# EAGLE schematic nedo1802_v1_0 (EAGLE 5.01)

## Sheet 1 of 2
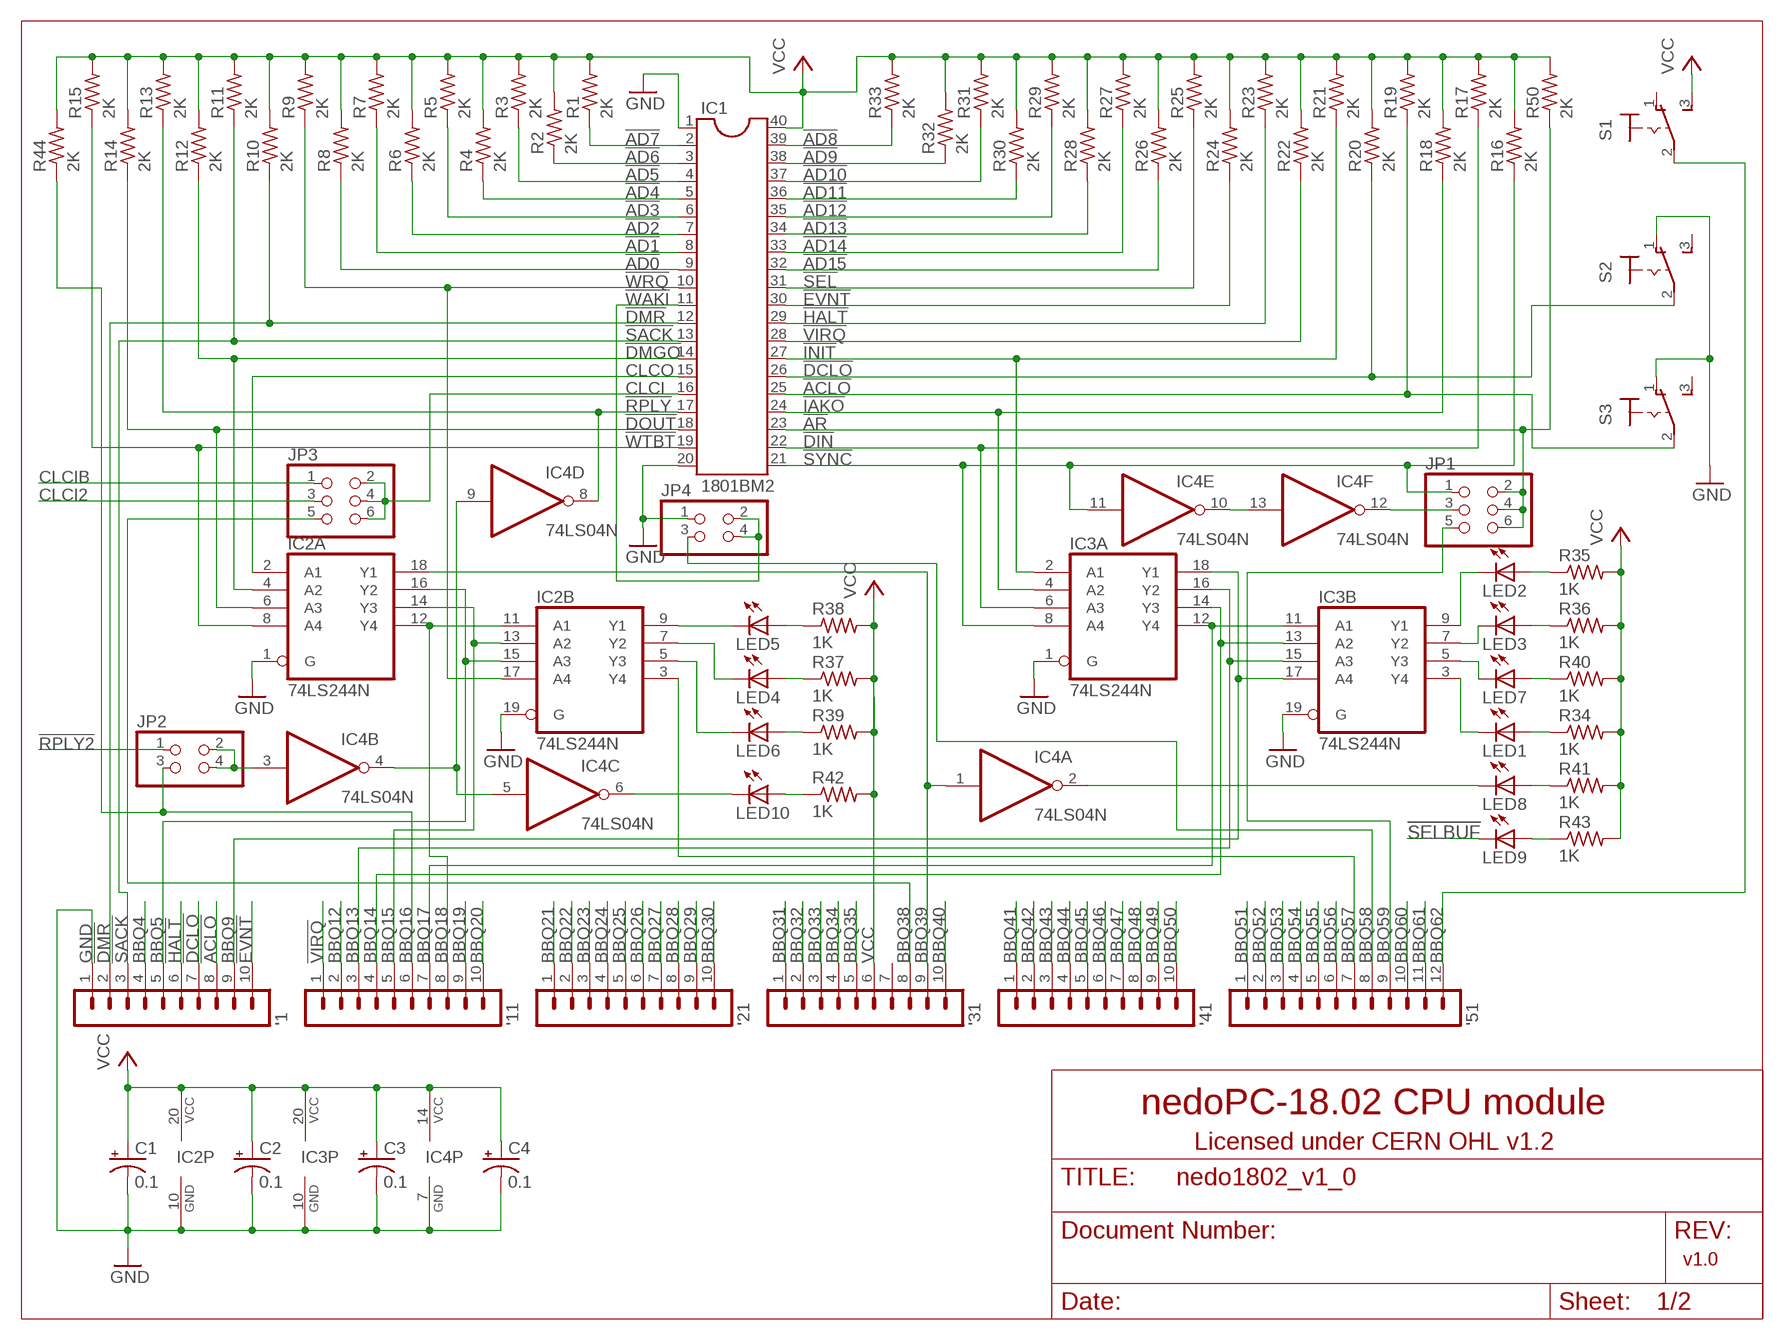
[diagram p0: schematic, sheet 1]

### Parts
'1  MA10-1  [MA10-1]
'11  MA10-1  [MA10-1]
'21  MA10-1  [MA10-1]
'31  MA10-1  [MA10-1]
'41  MA10-1  [MA10-1]
'51  MA12-1  [MA12-1]
C1  0.1  CPOL-USB45181B  [B45181B]
C2  0.1  CPOL-USB45181B  [B45181B]
C3  0.1  CPOL-USB45181B  [B45181B]
C4  0.1  CPOL-USB45181B  [B45181B]
IC1  1801BM2  DIL40  [DIL40]
IC2  74LS244N  [DIL20]
IC3  74LS244N  [DIL20]
IC4  74LS04N  [DIL14]
JP1  PINHD-2X3  [2X03]
JP2  PINHD-2X2  [2X02]
JP3  PINHD-2X3  [2X03]
JP4  PINHD-2X2  [2X02]
LED1  LED5MM  [LED5MM]
LED2  LED5MM  [LED5MM]
LED3  LED5MM  [LED5MM]
LED4  LED5MM  [LED5MM]
LED5  LED5MM  [LED5MM]
LED6  LED5MM  [LED5MM]
LED7  LED5MM  [LED5MM]
LED8  LED5MM  [LED5MM]
LED9  LED5MM  [LED5MM]
LED10  LED5MM  [LED5MM]
R1  2K  R-US_0204/7  [0204/7]
R2  2K  R-US_0204/7  [0204/7]
R3  2K  R-US_0204/7  [0204/7]
R4  2K  R-US_0204/7  [0204/7]
R5  2K  R-US_0204/7  [0204/7]
R6  2K  R-US_0204/7  [0204/7]
R7  2K  R-US_0204/7  [0204/7]
R8  2K  R-US_0204/7  [0204/7]
R9  2K  R-US_0204/7  [0204/7]
R10  2K  R-US_0204/7  [0204/7]
R11  2K  R-US_0204/7  [0204/7]
R12  2K  R-US_0204/7  [0204/7]
R13  2K  R-US_0204/7  [0204/7]
R14  2K  R-US_0204/7  [0204/7]
R15  2K  R-US_0204/7  [0204/7]
R16  2K  R-US_0204/7  [0204/7]
R17  2K  R-US_0204/7  [0204/7]
R18  2K  R-US_0204/7  [0204/7]
R19  2K  R-US_0204/7  [0204/7]
R20  2K  R-US_0204/7  [0204/7]
R21  2K  R-US_0204/7  [0204/7]
R22  2K  R-US_0204/7  [0204/7]
R23  2K  R-US_0204/7  [0204/7]
R24  2K  R-US_0204/7  [0204/7]
R25  2K  R-US_0204/7  [0204/7]
R26  2K  R-US_0204/7  [0204/7]
R27  2K  R-US_0204/7  [0204/7]
R28  2K  R-US_0204/7  [0204/7]
R29  2K  R-US_0204/7  [0204/7]
R30  2K  R-US_0204/7  [0204/7]
R31  2K  R-US_0204/7  [0204/7]
R32  2K  R-US_0204/7  [0204/7]
R33  2K  R-US_0204/7  [0204/7]
R34  1K  R-US_0204/7  [0204/7]
R35  1K  R-US_0204/7  [0204/7]
R36  1K  R-US_0204/7  [0204/7]
R37  1K  R-US_0204/7  [0204/7]
R38  1K  R-US_0204/7  [0204/7]
R39  1K  R-US_0204/7  [0204/7]
R40  1K  R-US_0204/7  [0204/7]
R41  1K  R-US_0204/7  [0204/7]
R42  1K  R-US_0204/7  [0204/7]
R43  1K  R-US_0204/7  [0204/7]
R44  2K  R-US_0204/7  [0204/7]
R50  2K  R-US_0204/7  [0204/7]
S1  320-916  [320-916]
S2  320-916  [320-916]
S3  320-916  [320-916]

### Nets
!ACLO: '1.8 IC1.25 R19.1 S3.2(P)
!AD0: IC1.9 R8.1 ; also sheet 2
!AD1: IC1.8 R7.1 ; also sheet 2
!AD2: IC1.7 R6.1 ; also sheet 2
!AD3: IC1.6 R5.1 ; also sheet 2
!AD4: IC1.5 R4.1 ; also sheet 2
!AD5: IC1.4 R3.1 ; also sheet 2
!AD6: IC1.3 R2.1 ; also sheet 2
!AD7: IC1.2 R1.1 ; also sheet 2
!AD8: IC1.39 R33.1 ; also sheet 2
!AD9: IC1.38 R32.1 ; also sheet 2
!AD10: IC1.37 R31.1 ; also sheet 2
!AD11: IC1.36 R30.1 ; also sheet 2
!AD12: IC1.35 R29.1 ; also sheet 2
!AD13: IC1.34 R28.1 ; also sheet 2
!AD14: IC1.33 R27.1 ; also sheet 2
!AD15: IC1.32 R26.1 ; also sheet 2
!AR: IC1.23 JP1.2 JP1.4 JP1.6 R50.1
!DCLO: '1.7 IC1.26 R20.1 S2.2(P)
!DIN: IC1.22 IC3.6(A:A3) R17.1
!DMGO: IC1.14 IC2.4(A:A2) R12.1
!DMR: '1.2 IC1.12 R10.1
!DOUT: IC1.18 IC2.6(A:A3) R14.1
!EVNT: '1.10 IC1.30 R24.1
!HALT: '1.6 IC1.29 R23.1
!IAKO: IC1.24 IC3.4(A:A2) R18.1
!INIT: IC1.27 IC3.2(A:A1) R21.1
!RPLY: IC1.17 IC4.8(D:O) R13.1
!RPLY2: JP2.1 ; also sheet 2
!SACK: '1.3 IC1.13 R11.1
!SEL: IC1.31 R25.1 ; also sheet 2
!SELBUF: LED9.K(C) ; also sheet 2
!SYNC: IC1.21 IC3.8(A:A4) IC4.11(E:I) JP1.1 R16.1
!VIRQ: '11.1 IC1.28 R22.1
!WAKI: IC1.11 JP4.2 JP4.4
!WRQ: IC1.10 IC2.17(B:A4) R9.1
!WTBT: IC1.19 IC2.8(A:A4) R15.1
BBQ4: '1.4
BBQ5: '1.5 IC2.15(B:A3) IC2.16(A:Y2)
BBQ9: '1.9 IC3.17(B:A4) IC3.18(A:Y1) ; also sheet 2
BBQ12: '11.2
BBQ13: '11.3 IC3.15(B:A3) IC3.16(A:Y2) ; also sheet 2
BBQ14: '11.4 IC3.13(B:A2) IC3.14(A:Y3) ; also sheet 2
BBQ15: '11.5 IC2.13(B:A2) IC2.14(A:Y3) ; also sheet 2
BBQ16: '11.6 JP2.3 R44.1
BBQ17: '11.7 IC3.11(B:A1) IC3.12(A:Y4) ; also sheet 2
BBQ18: '11.8 IC2.11(B:A1) IC2.12(A:Y4)
BBQ19: '11.9 ; also sheet 2
BBQ20: '11.10 ; also sheet 2
BBQ21: '21.1 ; also sheet 2
BBQ22: '21.2 ; also sheet 2
BBQ23: '21.3 ; also sheet 2
BBQ24: '21.4 ; also sheet 2
BBQ25: '21.5 ; also sheet 2
BBQ26: '21.6 ; also sheet 2
BBQ27: '21.7 ; also sheet 2
BBQ28: '21.8 ; also sheet 2
BBQ29: '21.9 ; also sheet 2
BBQ30: '21.10 ; also sheet 2
BBQ31: '31.1 ; also sheet 2
BBQ32: '31.2 ; also sheet 2
BBQ33: '31.3 ; also sheet 2
BBQ34: '31.4 ; also sheet 2
BBQ35: '31.5 ; also sheet 2
BBQ38: '31.8 JP3.5
BBQ39: '31.9 IC2.18(A:Y1) IC4.1(A:I) ; also sheet 2
BBQ40: '31.10 ; also sheet 2
BBQ41: '41.1 ; also sheet 2
BBQ42: '41.2 ; also sheet 2
BBQ43: '41.3 ; also sheet 2
BBQ44: '41.4 ; also sheet 2
BBQ45: '41.5 ; also sheet 2
BBQ46: '41.6 ; also sheet 2
BBQ47: '41.7 ; also sheet 2
BBQ48: '41.8 ; also sheet 2
BBQ49: '41.9 ; also sheet 2
BBQ50: '41.10 ; also sheet 2
BBQ51: '51.1 ; also sheet 2
BBQ52: '51.2 ; also sheet 2
BBQ53: '51.3 ; also sheet 2
BBQ54: '51.4 ; also sheet 2
BBQ55: '51.5 ; also sheet 2
BBQ56: '51.6 ; also sheet 2
BBQ57: '51.7 IC2.3(B:Y4)
BBQ58: '51.8 JP4.3
BBQ59: '51.9 JP1.5
BBQ60: '51.10
BBQ61: '51.11
BBQ62: '51.12 S1.2(P)
CLCI: IC1.16 JP3.2 JP3.4 JP3.6
CLCI2: JP3.3 ; also sheet 2
CLCIB: JP3.1 ; also sheet 2
CLCO: IC1.15 IC2.2(A:A1)
GND: '1.1 C1.- C2.- C3.- C4.- IC1.1 IC1.20 IC2.1(A:G) IC2.10(P:GND) IC2.19(B:G) IC3.1(A:G) IC3.10(P:GND) IC3.19(B:G) IC4.7(P:GND) JP4.1 S2.1(O) S3.1(O) ; also sheet 2
N$1: IC3.7(B:Y2) LED3.K(C)
N$2: IC3.5(B:Y3) LED7.K(C)
N$3: IC3.3(B:Y4) LED1.K(C)
N$4: IC3.9(B:Y1) LED2.K(C)
N$5: IC2.7(B:Y2) LED4.K(C)
N$6: IC2.5(B:Y3) LED6.K(C)
N$7: IC2.9(B:Y1) LED5.K(C)
N$8: LED5.A R38.1
N$9: LED4.A R37.1
N$10: LED6.A R39.1
N$11: IC4.4(B:O) IC4.5(C:I) IC4.9(D:I)
N$12: LED1.A R34.1
N$13: LED7.A R40.1
N$14: LED3.A R36.1
N$15: LED2.A R35.1
N$16: LED8.A R41.1
N$17: IC4.2(A:O) LED8.K(C)
N$18: LED10.A R42.1
N$19: IC4.6(C:O) LED10.K(C)
N$20: IC4.3(B:I) JP2.2 JP2.4
N$21: IC4.12(F:O) JP1.3
N$47: IC4.10(E:O) IC4.13(F:I)
N$51: LED9.A R43.1
VCC: '31.6 C1.+ C2.+ C3.+ C4.+ IC1.40 IC2.20(P:VCC) IC3.20(P:VCC) IC4.14(P:VCC) R1.2 R2.2 R3.2 R4.2 R5.2 R6.2 R7.2 R8.2 R9.2 R10.2 R11.2 R12.2 R13.2 R14.2 R15.2 R16.2 R17.2 R18.2 R19.2 R20.2 R21.2 R22.2 R23.2 R24.2 R25.2 R26.2 R27.2 R28.2 R29.2 R30.2 R31.2 R32.2 R33.2 R34.2 R35.2 R36.2 R37.2 R38.2 R39.2 R40.2 R41.2 R42.2 R43.2 R44.2 R50.2 S1.3(S) ; also sheet 2
Unconnected: '31.7 S1.1(O) S2.3(S) S3.3(S)

### Notes on the sheet
- nedoPC-18.02 CPU module
- Licensed under CERN OHL v1.2
- v1.0

## Sheet 2 of 2
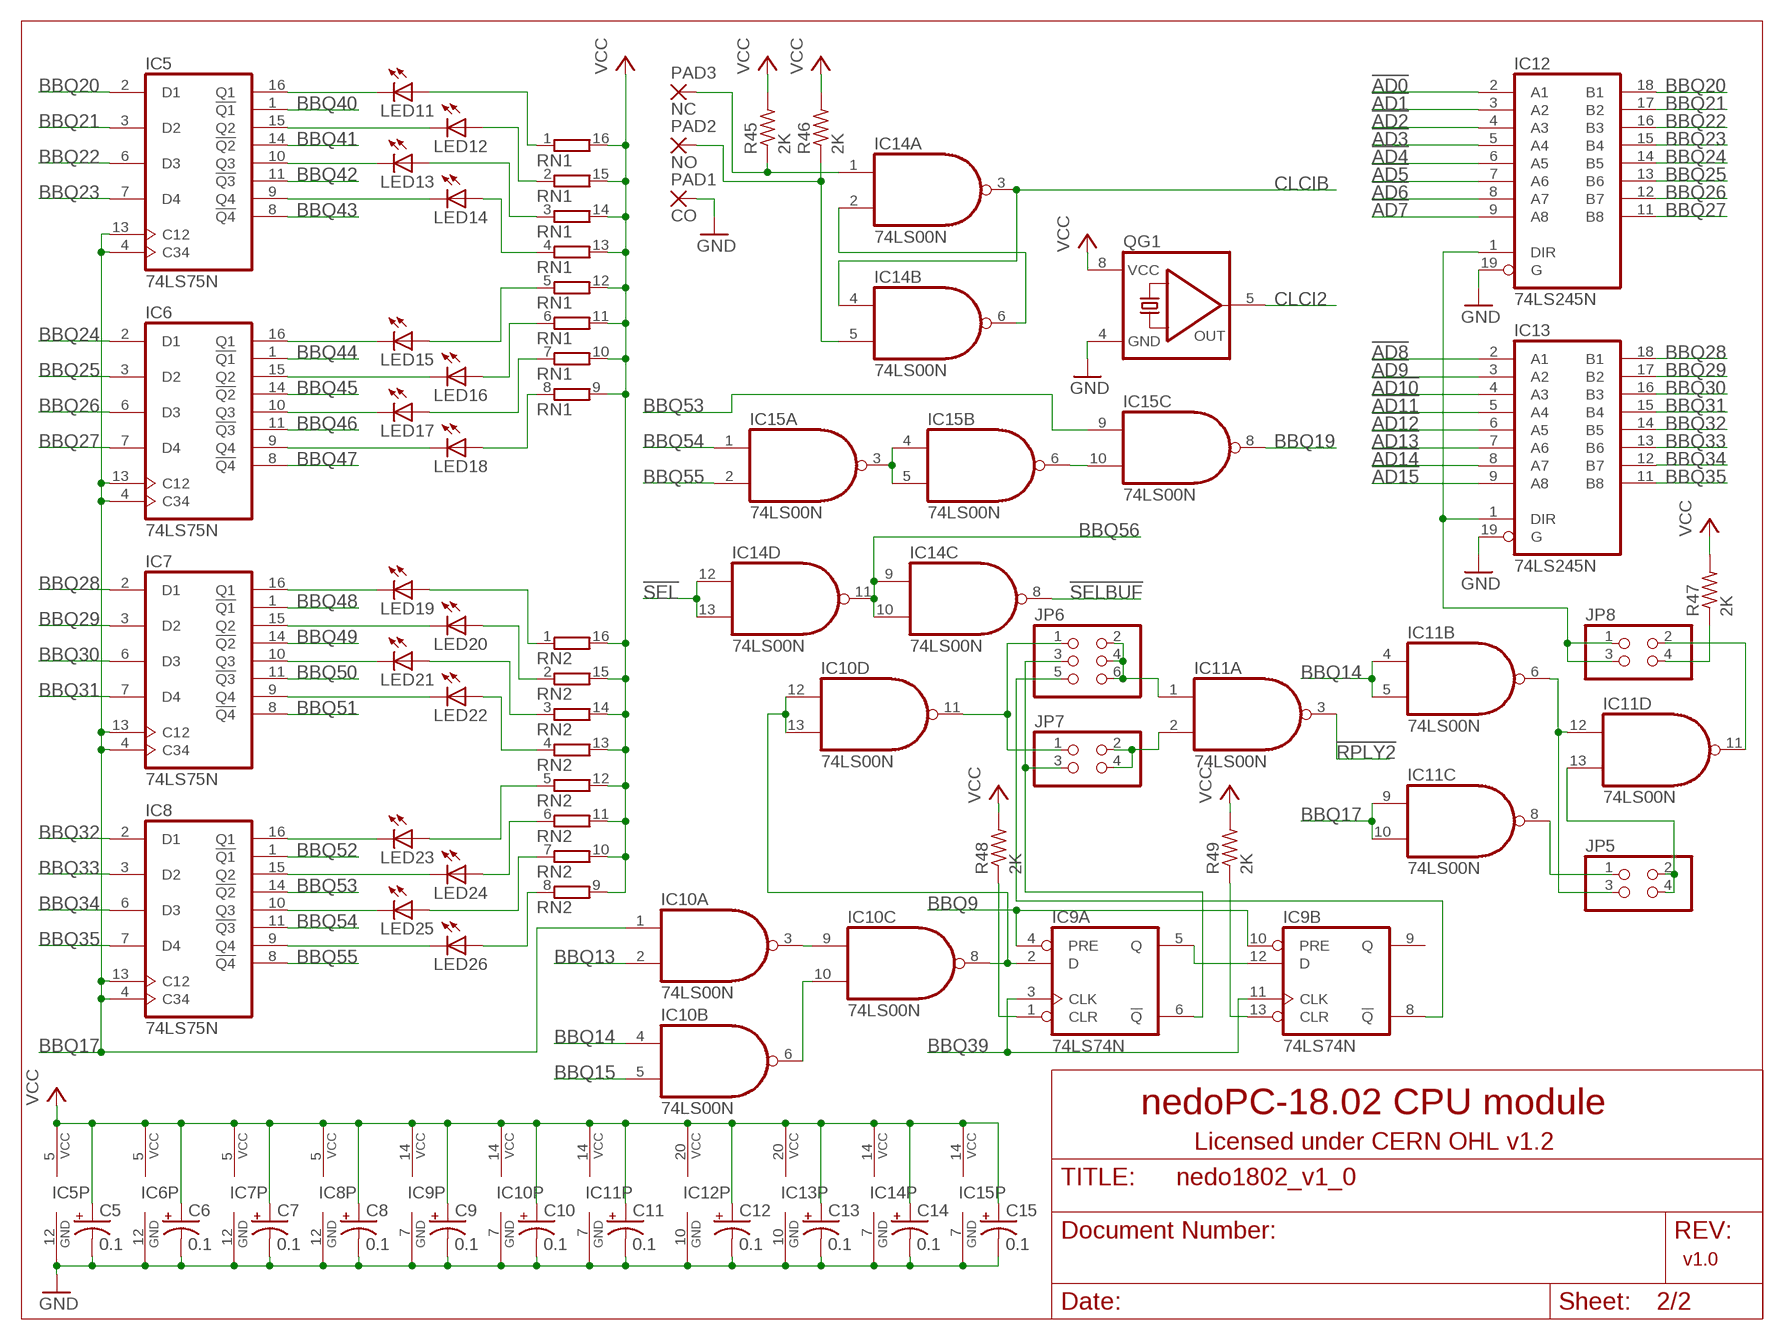
[diagram p1: schematic, sheet 2]

### Parts
C5  0.1  CPOL-USB45181B  [B45181B]
C6  0.1  CPOL-USB45181B  [B45181B]
C7  0.1  CPOL-USB45181B  [B45181B]
C8  0.1  CPOL-USB45181B  [B45181B]
C9  0.1  CPOL-USB45181B  [B45181B]
C10  0.1  CPOL-USB45181B  [B45181B]
C11  0.1  CPOL-USB45181B  [B45181B]
C12  0.1  CPOL-USB45181B  [B45181B]
C13  0.1  CPOL-USB45181B  [B45181B]
C14  0.1  CPOL-USB45181B  [B45181B]
C15  0.1  CPOL-USB45181B  [B45181B]
IC5  74LS75N  [DIL16]
IC6  74LS75N  [DIL16]
IC7  74LS75N  [DIL16]
IC8  74LS75N  [DIL16]
IC9  74LS74N  [DIL14]
IC10  74LS00N  [DIL14]
IC11  74LS00N  [DIL14]
IC12  74LS245N  [DIL20]
IC13  74LS245N  [DIL20]
IC14  74LS00N  [DIL14]
IC15  74LS00N  [DIL14]
JP5  PINHD-2X2  [2X02]
JP6  PINHD-2X3  [2X03]
JP7  PINHD-2X2  [2X02]
JP8  PINHD-2X2  [2X02]
LED11  LED3MM  [LED3MM]
LED12  LED3MM  [LED3MM]
LED13  LED3MM  [LED3MM]
LED14  LED3MM  [LED3MM]
LED15  LED3MM  [LED3MM]
LED16  LED3MM  [LED3MM]
LED17  LED3MM  [LED3MM]
LED18  LED3MM  [LED3MM]
LED19  LED3MM  [LED3MM]
LED20  LED3MM  [LED3MM]
LED21  LED3MM  [LED3MM]
LED22  LED3MM  [LED3MM]
LED23  LED3MM  [LED3MM]
LED24  LED3MM  [LED3MM]
LED25  LED3MM  [LED3MM]
LED26  LED3MM  [LED3MM]
PAD1  CO  WIREPAD4,16O1,6  [4,16O1,6]
PAD2  NO  WIREPAD4,16O1,6  [4,16O1,6]
PAD3  NC  WIREPAD4,16O1,6  [4,16O1,6]
QG1  QG5460  [DIL08S]
R45  2K  R-US_0204/7  [0204/7]
R46  2K  R-US_0204/7  [0204/7]
R47  2K  R-US_0204/7  [0204/7]
R48  2K  R-US_0204/7  [0204/7]
R49  2K  R-US_0204/7  [0204/7]
RN1  8R-P  [DIL16]
RN2  8R-P  [DIL16]

### Nets
!AD0: IC12.2(A1) ; also sheet 1
!AD1: IC12.3(A2) ; also sheet 1
!AD2: IC12.4(A3) ; also sheet 1
!AD3: IC12.5(A4) ; also sheet 1
!AD4: IC12.6(A5) ; also sheet 1
!AD5: IC12.7(A6) ; also sheet 1
!AD6: IC12.8(A7) ; also sheet 1
!AD7: IC12.9(A8) ; also sheet 1
!AD8: IC13.2(A1) ; also sheet 1
!AD9: IC13.3(A2) ; also sheet 1
!AD10: IC13.4(A3) ; also sheet 1
!AD11: IC13.5(A4) ; also sheet 1
!AD12: IC13.6(A5) ; also sheet 1
!AD13: IC13.7(A6) ; also sheet 1
!AD14: IC13.8(A7) ; also sheet 1
!AD15: IC13.9(A8) ; also sheet 1
!RPLY2: IC11.3(A:O) ; also sheet 1
!SEL: IC14.12(D:I0) IC14.13(D:I1) ; also sheet 1
!SELBUF: IC14.8(C:O) ; also sheet 1
BBQ9: IC9.4(A:PRE) IC9.10(B:PRE) ; also sheet 1
BBQ13: IC10.2(A:I1) ; also sheet 1
BBQ14: IC10.4(B:I0) IC11.4(B:I0) IC11.5(B:I1) ; also sheet 1
BBQ15: IC10.5(B:I1) ; also sheet 1
BBQ17: IC5.4(C34) IC5.13(C12) IC6.4(C34) IC6.13(C12) IC7.4(C34) IC7.13(C12) IC8.4(C34) IC8.13(C12) IC10.1(A:I0) IC11.9(C:I0) IC11.10(C:I1) ; also sheet 1
BBQ19: IC15.8(C:O) ; also sheet 1
BBQ20: IC5.2(D1) IC12.18(B1) ; also sheet 1
BBQ21: IC5.3(D2) IC12.17(B2) ; also sheet 1
BBQ22: IC5.6(D3) IC12.16(B3) ; also sheet 1
BBQ23: IC5.7(D4) IC12.15(B4) ; also sheet 1
BBQ24: IC6.2(D1) IC12.14(B5) ; also sheet 1
BBQ25: IC6.3(D2) IC12.13(B6) ; also sheet 1
BBQ26: IC6.6(D3) IC12.12(B7) ; also sheet 1
BBQ27: IC6.7(D4) IC12.11(B8) ; also sheet 1
BBQ28: IC7.2(D1) IC13.18(B1) ; also sheet 1
BBQ29: IC7.3(D2) IC13.17(B2) ; also sheet 1
BBQ30: IC7.6(D3) IC13.16(B3) ; also sheet 1
BBQ31: IC7.7(D4) IC13.15(B4) ; also sheet 1
BBQ32: IC8.2(D1) IC13.14(B5) ; also sheet 1
BBQ33: IC8.3(D2) IC13.13(B6) ; also sheet 1
BBQ34: IC8.6(D3) IC13.12(B7) ; also sheet 1
BBQ35: IC8.7(D4) IC13.11(B8) ; also sheet 1
BBQ39: IC9.3(A:CLK) IC9.11(B:CLK) ; also sheet 1
BBQ40: IC5.1(!Q1) ; also sheet 1
BBQ41: IC5.14(!Q2) ; also sheet 1
BBQ42: IC5.11(!Q3) ; also sheet 1
BBQ43: IC5.8(!Q4) ; also sheet 1
BBQ44: IC6.1(!Q1) ; also sheet 1
BBQ45: IC6.14(!Q2) ; also sheet 1
BBQ46: IC6.11(!Q3) ; also sheet 1
BBQ47: IC6.8(!Q4) ; also sheet 1
BBQ48: IC7.1(!Q1) ; also sheet 1
BBQ49: IC7.14(!Q2) ; also sheet 1
BBQ50: IC7.11(!Q3) ; also sheet 1
BBQ51: IC7.8(!Q4) ; also sheet 1
BBQ52: IC8.1(!Q1) ; also sheet 1
BBQ53: IC8.14(!Q2) IC15.9(C:I0) ; also sheet 1
BBQ54: IC8.11(!Q3) IC15.1(A:I0) ; also sheet 1
BBQ55: IC8.8(!Q4) IC15.2(A:I1) ; also sheet 1
BBQ56: IC14.9(C:I0) IC14.10(C:I1) IC14.11(D:O) ; also sheet 1
CLCI2: QG1.5(OUT) ; also sheet 1
CLCIB: IC14.3(A:O) IC14.4(B:I0) ; also sheet 1
GND: C5.- C6.- C7.- C8.- C9.- C10.- C11.- C12.- C13.- C14.- C15.- IC5.12(GND) IC6.12(GND) IC7.12(GND) IC8.12(GND) IC9.7(P:GND) IC10.7(P:GND) IC11.7(P:GND) IC12.10(GND) IC12.19(G) IC13.10(GND) IC13.19(G) IC14.7(P:GND) IC15.7(P:GND) PAD1.1(P) QG1.4(GND) ; also sheet 1
N$22: IC9.1(A:CLR) R48.1
N$23: IC5.16(Q1) LED11.K(C)
N$24: LED14.A RN1.4
N$25: LED13.A RN1.3
N$26: LED12.A RN1.2
N$27: LED11.A RN1.1
N$28: IC12.1(DIR) IC13.1(DIR) JP8.1 JP8.3
N$29: LED15.A RN1.5
N$30: LED16.A RN1.6
N$31: LED17.A RN1.7
N$32: LED18.A RN1.8
N$33: LED19.A RN2.1
N$34: LED20.A RN2.2
N$35: LED21.A RN2.3
N$36: LED22.A RN2.4
N$37: LED23.A RN2.5
N$38: LED24.A RN2.6
N$39: LED25.A RN2.7
N$40: LED26.A RN2.8
N$41: IC11.6(B:O) IC11.12(D:I0) JP5.3
N$42: IC5.15(Q2) LED12.K(C)
N$43: IC11.8(C:O) JP5.1
N$44: IC5.10(Q3) LED13.K(C)
N$45: IC11.13(D:I1) JP5.2 JP5.4
N$46: IC5.9(Q4) LED14.K(C)
N$48: IC6.16(Q1) LED15.K(C)
N$49: IC9.13(B:CLR) R49.1
N$50: IC6.15(Q2) LED16.K(C)
N$52: IC6.10(Q3) LED17.K(C)
N$53: IC9.5(A:Q) IC9.12(B:D)
N$54: IC6.9(Q4) LED18.K(C)
N$55: IC10.3(A:O) IC10.9(C:I0)
N$56: IC7.16(Q1) LED19.K(C)
N$57: IC10.6(B:O) IC10.10(C:I1)
N$58: IC7.15(Q2) LED20.K(C)
N$59: IC11.11(D:O) JP8.2
N$60: IC7.10(Q3) LED21.K(C)
N$62: IC7.9(Q4) LED22.K(C)
N$63: IC9.6(A:!Q) JP6.3 JP7.3
N$64: IC8.16(Q1) LED23.K(C)
N$65: IC9.8(B:!Q) JP6.5
N$66: IC8.15(Q2) LED24.K(C)
N$67: IC11.1(A:I0) JP6.2 JP6.4 JP6.6
N$68: IC8.10(Q3) LED25.K(C)
N$69: IC11.2(A:I1) JP7.2 JP7.4
N$70: IC8.9(Q4) LED26.K(C)
N$71: JP8.4 R47.1
N$72: IC10.11(D:O) JP6.1 JP7.1
N$73: IC14.1(A:I0) PAD3.1(P) R45.1
N$74: IC14.5(B:I1) PAD2.1(P) R46.1
N$76: IC14.2(A:I1) IC14.6(B:O)
N$77: IC15.3(A:O) IC15.4(B:I0) IC15.5(B:I1)
N$78: IC15.6(B:O) IC15.10(C:I1)
N$79: IC9.2(A:D) IC10.8(C:O) IC10.12(D:I0) IC10.13(D:I1)
VCC: C5.+ C6.+ C7.+ C8.+ C9.+ C10.+ C11.+ C12.+ C13.+ C14.+ C15.+ IC5.5(VCC) IC6.5(VCC) IC7.5(VCC) IC8.5(VCC) IC9.14(P:VCC) IC10.14(P:VCC) IC11.14(P:VCC) IC12.20(VCC) IC13.20(VCC) IC14.14(P:VCC) IC15.14(P:VCC) QG1.8(VCC) R45.2 R46.2 R47.2 R48.2 R49.2 RN1.9 RN1.10 RN1.11 RN1.12 RN1.13 RN1.14 RN1.15 RN1.16 RN2.9 RN2.10 RN2.11 RN2.12 RN2.13 RN2.14 RN2.15 RN2.16 ; also sheet 1
Unconnected: IC9.9(B:Q) IC15.11(D:O) IC15.12(D:I0) IC15.13(D:I1)

### Notes on the sheet
- nedoPC-18.02 CPU module
- Licensed under CERN OHL v1.2
- v1.0

## Library data of the parts
'1 '11 '21 '31 '41 = con-lstb:MA10-1: PIN HEADER
'51 = con-lstb:MA12-1: PIN HEADER
C1-C15 = rcl:CPOL-US: POLARIZED CAPACITOR, American symbol
IC1 = ic-package:DIL40: Dual In Line
IC2 IC3 = 74xx-us:74*244: Octal BUFFER and LINE DRIVER, 3-state
IC4 = 74xx-us:74*04: Hex INVERTER
IC5-IC8 = 74xx-us:74*75: 4-bit bistable LATCH
IC9 = 74xx-us:74*74: Dual D type positive edge triggered FLIP FLOP, preset and clear
IC10 IC11 IC14 IC15 = 74xx-us:74*00: Quad 2-input NAND gate
IC12 IC13 = 74xx-us:74*245: Octal BUS TRANSCEIVER, 3-state
JP1 JP3 JP6 = pinhead:PINHD-2X3: PIN HEADER
JP2 JP4 JP5 JP7 JP8 = pinhead:PINHD-2X2: PIN HEADER
LED1-LED26 = led:LED: LED OSRAM: - CHIPLED LG R971, LG N971, LY N971, LG Q971, LY Q971, LO R971, LY R971 LH N974, LH R974 LS Q976, LO Q976, LY Q976 LO Q996 - Hyper CHIPLED LW Q18S LB Q993, LB Q99A, LB R99A - SideLED LS A670, LO A670, LY A670, LG A670, LP A670 LB A673, LV A673, LT A673, LW A673 LH A674 LY A675 LS A676, LA A676, LO A676, LY A676, LW A676 LS A679, LY A679, LG A679 - Hyper Micro SIDELED® LS Y876, LA Y876, LO Y876, LY Y876 LT Y87S - SmartLED LW L88C, LW L88S LB L89C, LB L89S, LG L890 LS L89K, LO L89K, LY L89K LS L896, LA L896, LO L896, LY L896 - TOPLED LS T670, LO T670, LY T670, LG T670, LP T670 LSG T670, LSP T670, LSY T670, LOP T670, LYG T670 LG T671, LOG T671, LSG T671 LB T673, LV T673, LT T673, LW T673 LH T674 LS T676, LA T676, LO T676, LY T676, LB T676, LH T676, LSB T676, LW T676 LB T67C, LV T67C, LT T67C, LS T67K, LO T67K, LY T67K, LW E67C LS E67B, LA E67B, LO E67B, LY E67B, LB E67C, LV E67C, LT E67C LW T67C LS T679, LY T679, LG T679 LS T770, LO T770, LY T770, LG T770, LP T770 LB T773, LV T773, LT T773, LW T773 LH T774 LS E675, LA E675, LY E675, LS T675 LS T776, LA T776, LO T776, LY T776, LB T776 LHGB T686 LT T68C, LB T68C - Hyper Mini TOPLED® LB M676 - Mini TOPLED Santana® LG M470 LS M47K, LO M47K, LY M47K Source: http://www.osram.convergy.de - LUMILED® LXK2-PW12-R00, LXK2-PW12-S00, LXK2-PW14-U00, LXK2-PW14-V00 LXK2-PM12-R00, LXK2-PM12-S00, LXK2-PM14-U00 LXK2-PE12-Q00, LXK2-PE12-R00, LXK2-PE12-S00, LXK2-PE14-T00, LXK2-PE14-U00 LXK2-PB12-K00, LXK2-PB12-L00, LXK2-PB12-M00, LXK2-PB14-N00, LXK2-PB14-P00, LXK2-PB14-Q00 LXK2-PR12-L00, LXK2-PR12-M00, LXK2-PR14-Q00, LXK2-PR14-R00 LXK2-PD12-Q00, LXK2-PD12-R00, LXK2-PD12-S00 LXK2-PH12-R00, LXK2-PH12-S00 LXK2-PL12-P00, LXK2-PL12-Q00, LXK2-PL12-R00 Source: www.luxeon.com
PAD1-PAD3 = wirepad:WIREPAD: Wire PAD connect wire on PCB
QG1 = crystal:QG5460: CRYSTAL RESONATOR
R1-R50 = rcl:R-US_: RESISTOR, American symbol
RN1 RN2 = resistor-dil:8R-P: DIL RESISTOR
S1-S3 = switch:320-916: TOGGLE SWITCH distributor RS Components